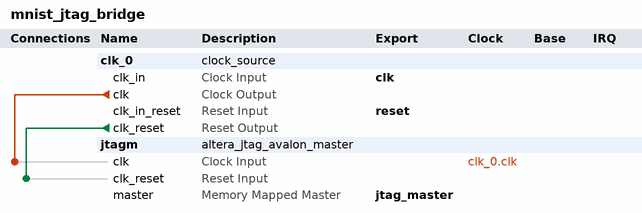
[diagram p0: system contents]
# Platform Designer (Qsys) system mnist_jtag_bridge, Cyclone V 5CSEMA5F31C6
# Parameters at their usual value, and those the tool derives, are not listed.
package require -exact qsys 25.1
create_system mnist_jtag_bridge
set_project_property DEVICE_FAMILY {Cyclone V}
set_project_property DEVICE 5CSEMA5F31C6

add_instance clk_0 clock_source 25.1
set_instance_parameter_value clk_0 clockFrequency 50000000

add_instance jtagm altera_jtag_avalon_master 25.1
set_instance_parameter_value jtagm FAST_VER 1

# connections
add_connection clk_0.clk jtagm.clk clock
add_connection clk_0.clk_reset jtagm.clk_reset reset

# exported interfaces
add_interface clk clock sink
set_interface_property clk EXPORT_OF clk_0.clk_in
add_interface jtag_master avalon master
set_interface_property jtag_master EXPORT_OF jtagm.master
add_interface reset reset sink
set_interface_property reset EXPORT_OF clk_0.clk_in_reset

set_interconnect_requirement {$system} qsys_mm.clockCrossingAdapter HANDSHAKE
set_interconnect_requirement {$system} qsys_mm.enableEccProtection FALSE
set_interconnect_requirement {$system} qsys_mm.insertDefaultSlave FALSE
set_interconnect_requirement {$system} qsys_mm.maxAdditionalLatency 1

save_system mnist_jtag_bridge.qsys
